# Altium schematic sheet 16Bit Group Ripple Adder.SchDoc
size A; Organization: Altium Limited; Address1: L3, 12a Rodborough Rd; Address2: Frenchs Forest; Address3: NSW; Address4: Australia 2086; DocumentNumber: 1; SheetNumber: 1; SheetTotal: 1
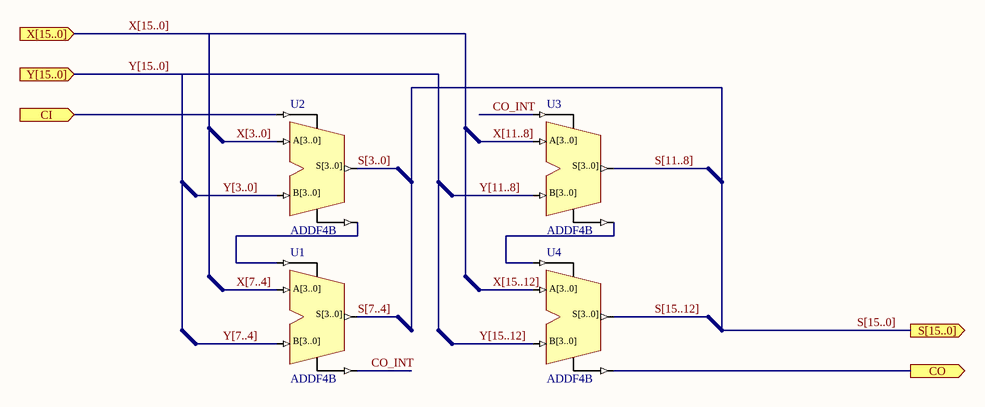
[diagram p0: 16Bit Group Ripple Adder.SchDoc]

## Parts
U1  ADDF4B
U2  ADDF4B
U3  ADDF4B
U4  ADDF4B

## Ports
CI (in), CO (out), S[15..0] (out), X[15..0] (in), Y[15..0] (in)

## Nets
CI: U2.CI ; port CI
CO: U4.CO ; port CO
CO_INT: U1.CO U3.CI
S[3..0]: U2.S[3..0]
S[7..4]: U1.S[3..0]
S[11..8]: U3.S[3..0]
S[15..12]: U4.S[3..0]
X[3..0]: U2.A[3..0]
X[7..4]: U1.A[3..0]
X[11..8]: U3.A[3..0]
X[15..12]: U4.A[3..0]
Y[3..0]: U2.B[3..0]
Y[7..4]: U1.B[3..0]
Y[11..8]: U3.B[3..0]
Y[15..12]: U4.B[3..0]
NetU1_CI: U1.CI U2.CO
NetU3_CO: U3.CO U4.CI

## Buses and harness runs
bus S[3..0]
bus S[7..4]
bus S[11..8]
bus S[15..0] = port S[15..0]
bus S[15..12]
bus X[3..0]
bus X[7..4]
bus X[11..8]
bus X[15..0] = port X[15..0]
bus X[15..12]
bus Y[3..0]
bus Y[7..4]
bus Y[11..8]
bus Y[15..0] = port Y[15..0]
bus Y[15..12]

## Notes on the sheet
- Title
- Size:
- Date:
- A
- Number:
- Time:
- Revision:
- Sheet
- of
- File:

## Library data of the parts
U1-U4 = ADDF4B: 4-Bit Cascadable Unsigned Binary Full Adder, Bus Version; ArchiveName: GENERIC; VHDLIB_SIM: GENERIC_LIB; Published: 29-Jan-2004; Publisher: Altium Limited; Core Revision: 1.00.00